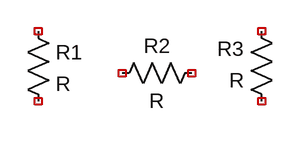
[diagram p0: schematic Draft1.asc]
Draft1.asc, the LTspice schematic file:
Version 4
SHEET 1 880 680
SYMBOL res 64 48 R0
SYMATTR InstName R1
SYMBOL res 272 96 R90
WINDOW 0 0 56 VBottom 2
WINDOW 3 32 56 VTop 2
SYMATTR InstName R2
SYMBOL res 352 160 R180
WINDOW 0 36 76 Left 2
WINDOW 3 36 40 Left 2
SYMATTR InstName R3

The netlist it stands for:
* Draft1.asc
R1 NC_01 NC_02 R
R2 NC_03 NC_04 R
R3 NC_05 NC_06 R
.backanno
.end